# Altium schematic sheet muhtas_1.SchDoc
size A4; SheetNumber: 1; SheetTotal: 1
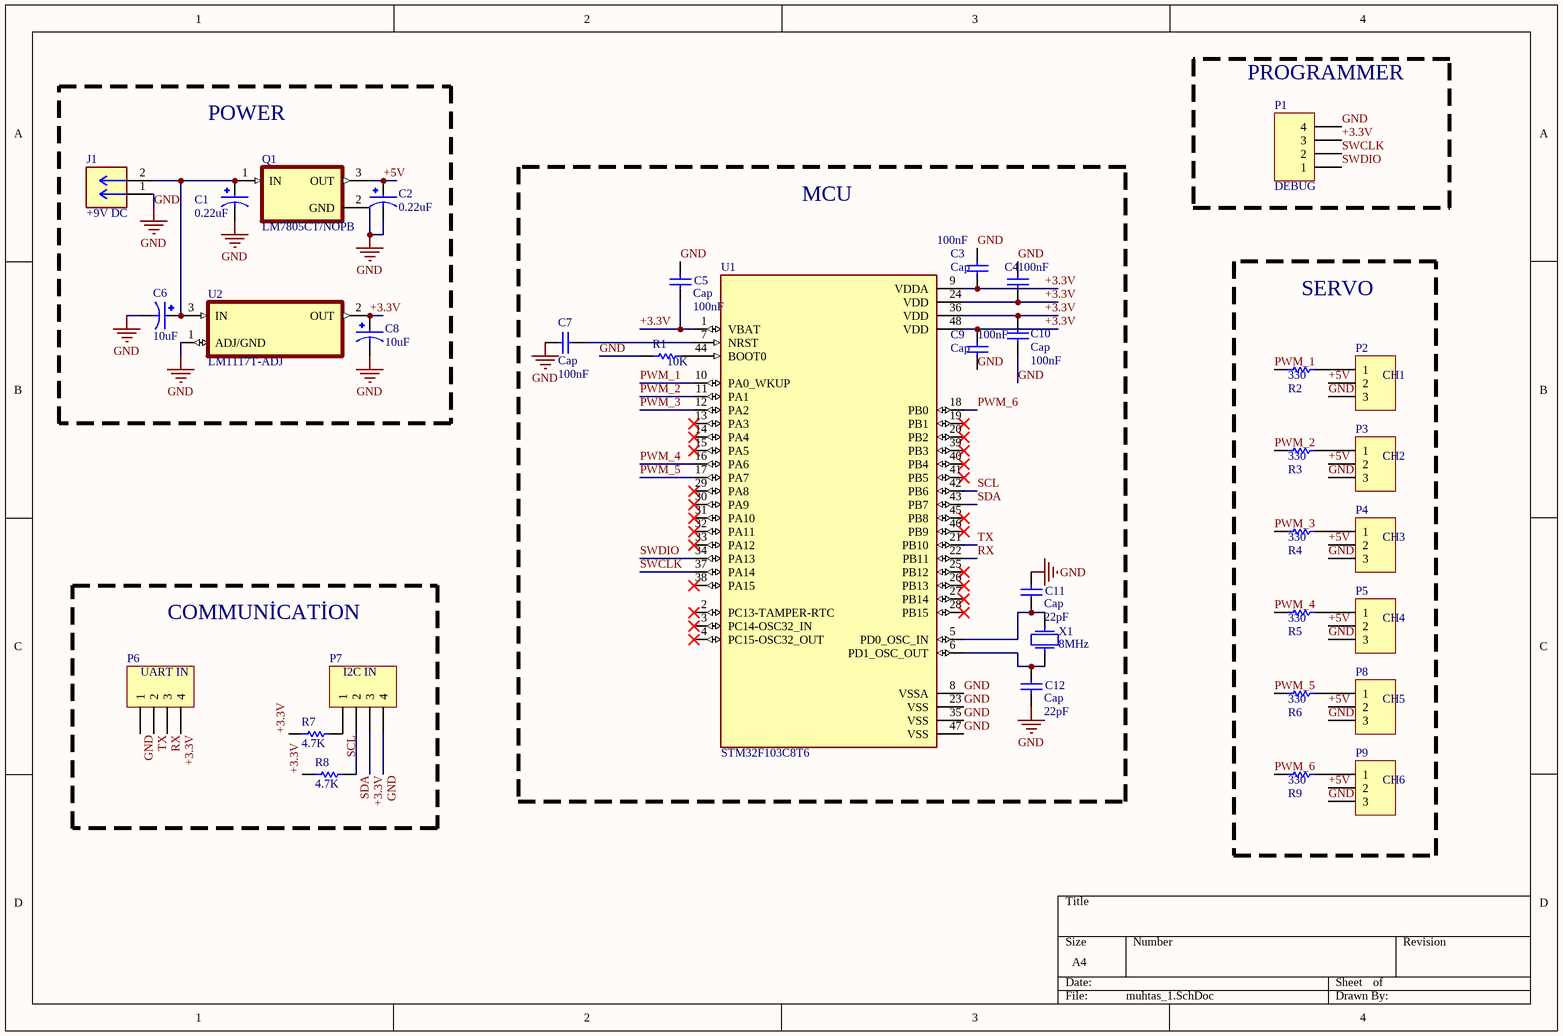
[diagram p0: muhtas_1.SchDoc]

## Parts
C1  0.22uF  [CAPPRD250W50D630H1120]
C2  0.22uF  [CAPPRD250W50D630H1120]
C3  Cap  value 100nF  [CAPPRD250W50D630H1120]
C4  value 100nF  [CAPPRD250W50D630H1120]
C5  Cap  value 100nF  [CAPPRD250W50D630H1120]
C6  10uF  [CAPPRD250W50D630H1120]
C7  Cap  value 100nF  [CAPPRD250W50D630H1120]
C8  10uF  [CAPPRD250W50D630H1120]
C9  Cap  value 100nF  [CAPPRD250W50D630H1120]
C10  Cap  value 100nF  [CAPPRD250W50D630H1120]
C11  Cap  value 22pF  [CAPPRD250W50D630H1120]
C12  Cap  value 22pF  [CAPPRD250W50D630H1120]
J1  +9V DC  [CONN_39773-0002_MOL]
P1  DEBUG  [HDR1X4]
P2  CH1  [HDR1X3]
P3  CH2  [HDR1X3]
P4  CH3  [HDR1X3]
P5  CH4  [HDR1X3]
P6  UART IN  [HDR1X4]
P7  I2C IN  [HDR1X4]
P8  CH5  [HDR1X3]
P9  CH6  [HDR1X3]
Q1  LM7805CT/NOPB  [TO254P1054X470X2600-3]
R1  value 10K  [AXIAL-0.3]  (hidden comment: Resistor)
R2  value 330  [AXIAL-0.3]  (hidden comment: Resistor)
R3  value 330  [AXIAL-0.3]  (hidden comment: Resistor)
R4  value 330  [AXIAL-0.3]  (hidden comment: Resistor)
R5  value 330  [AXIAL-0.3]  (hidden comment: Resistor)
R6  value 330  [AXIAL-0.3]  (hidden comment: Resistor)
R7  value 4.7K  [AXIAL-0.3]  (hidden comment: Resistor)
R8  value 4.7K  [AXIAL-0.3]  (hidden comment: Resistor)
R9  value 330  [AXIAL-0.3]  (hidden comment: Resistor)
U1  STM32F103C8T6  [QFP50P900X900X160-48N]
U2  LM1117T-ADJ  [TO254P1054X470X1955-3]
X1  F0: 8MHz  [RAD-0.1]  (hidden comment: Crystal)

## Blocks framed on the sheet
POWER: C1 C2 C6 C8 J1 Q1 U2
PROGRAMMER: P1
MCU: C3-C5 C7 C9-C12 R1 U1 X1
SERVO: P2-P5 P8 P9 R2-R6 R9
COMMUNİCATİON: P6 P7 R7 R8

## Nets
GND: C1.N C2.N C3.1 C4.1 C5.2 C6.N C7.2 C8.N C9.2 C10.2 C11.2 C12.1 J1.1 P1.4 P2.3 P3.3 P4.3 P5.3 P6.1 P7.4 P8.3 P9.3 Q1.2(GND) R1.1 U1.8(VSSA) U1.23(VSS) U1.35(VSS) U1.47(VSS) U2.1(ADJ/GND)
+3.3V: C3.2 C4.2 C5.1 C8.P C9.1 C10.1 P1.3 P6.4 P7.3 R7.2 R8.2 U1.1(VBAT) U1.9(VDDA) U1.24(VDD) U1.36(VDD) U1.48(VDD) U2.2(OUT)
+5V: C2.P P2.2 P3.2 P4.2 P5.2 P8.2 P9.2 Q1.3(OUT)
PWM_1: R2.1 U1.10(PA0_WKUP)
PWM_2: R3.1 U1.11(PA1)
PWM_3: R4.1 U1.12(PA2)
PWM_4: R5.1 U1.16(PA6)
PWM_5: R6.1 U1.17(PA7)
PWM_6: R9.1 U1.18(PB0)
RX: P6.3 U1.22(PB11)
SCL: P7.1 R7.1 U1.42(PB6)
SDA: P7.2 R8.1 U1.43(PB7)
SWCLK: P1.2 U1.37(PA14)
SWDIO: P1.1 U1.34(PA13)
TX: P6.2 U1.21(PB10)
NetC1_P: C1.P C6.P J1.2 Q1.1(IN) U2.3(IN)
NetC7_1: C7.1 U1.7(NRST)
NetC11_1: C11.1 U1.5(PD0_OSC_IN) X1.2
NetC12_2: C12.2 U1.6(PD1_OSC_OUT) X1.1
NetP2_1: P2.1 R2.2
NetP3_1: P3.1 R3.2
NetP4_1: P4.1 R4.2
NetP5_1: P5.1 R5.2
NetP8_1: P8.1 R6.2
NetP9_1: P9.1 R9.2
NetR1_2: R1.2 U1.44(BOOT0)

Not connected (* = marked no-connect by the designer): U1 2(PC13-TAMPER-RTC)* 3(PC14-OSC32_IN)* 4(PC15-OSC32_OUT)* 13(PA3)* 14(PA4)* 15(PA5)* 19(PB1)* 20(PB2)* 25(PB12)* 26(PB13)* 27(PB14)* 28(PB15)* 29(PA8)* 30(PA9)* 31(PA10)* 32(PA11)* 33(PA12)* 38(PA15)* 39(PB3)* 40(PB4)* 41(PB5)* 45(PB8)* 46(PB9)*

## Library data of the parts
C1 C2 C6 C8 = ECEA1HN100UI: CAP ALUM 10UF 20% 50V RADIAL; MP: ECE-A1HN100UI; MF: Panasonic; SnapEDA_Link: https://www.snapeda.com/parts/ECE-A1HN100UI/Panasonic/view-part/2321690/?ref=snap; Price: None; Check_prices: https://www.snapeda.com/parts/ECE-A1HN100UI/Panasonic/view-part/2321690/?ref=eda; Value: *; Availability: In Stock; Package: RADIAL-2 Panasonic
C3-C5 C7 C9-C12 = Cap: Capacitor; pin to pad: 1>P 2>N; Published: 8-Jun-2000; LatestRevisionDate: 17-Jul-2002; LatestRevisionNote: Re-released for DXP Platform.; PackageReference: RAD-0.3; Publisher: Altium Limited; PackageDescription: Radial Cap, Thru-Hole; 2 Leads; 0.3 in Pin Spacing
J1 = 397730002: 2 Position Wire to Board Terminal Block Horizontal with Board 0.100 (2.54mm) Through Hole; MF: Molex; SnapEDA_Link: https://www.snapeda.com/parts/397730002/Molex/view-part/?ref=snap; Package: None; Value: *; MP: 397730002; Check_prices: https://www.snapeda.com/parts/397730002/Molex/view-part/?ref=eda
P1 P6 P7 = Header 4: Header, 4-Pin; LatestRevisionDate: 17-Jul-2002; LatestRevisionNote: Re-released for DXP Platform.; Publisher: Altium Limited
P2-P5 P8 P9 = Header 3: Header, 3-Pin; LatestRevisionDate: 17-Jul-2002; LatestRevisionNote: Re-released for DXP Platform.; Publisher: Altium Limited
Q1 = LM7805CT/NOPB: Linear Voltage Regulator IC Positive Fixed 1 Output 1.5A TO-220-3; MF: ON Semiconductor; Purchase-URL: https://pricing.snapeda.com/search/part/LM7805CT/?ref=eda; Check_prices: https://www.snapeda.com/parts/LM7805CT/Onsemi/view-part/?ref=eda; SnapEDA_Link: https://www.snapeda.com/parts/LM7805CT/Onsemi/view-part/?ref=snap; Price: None; Availability: In Stock; Package: TO-220-3 ON Semiconductor; MP: LM7805CT; Value: *
R1-R9 = Resistor: TC1: 0; SimulationGenericComponent: True; TC2: 0
U1 = STM32F103C8T6: ARM® Cortex®-M3 STM32F1 Microcontroller IC 32-Bit 72MHz 64KB (64K x 8) FLASH 48-LQFP (7x7); MF: STMicroelectronics; SnapEDA_Link: https://www.snapeda.com/parts/STM32F103C8T6/STMicroelectronics/view-part/?ref=snap; Package: LQFP-48 STMicroelectronics; Value: *; MP: STM32F103C8T6; Check_prices: https://www.snapeda.com/parts/STM32F103C8T6/STMicroelectronics/view-part/?ref=eda
U2 = LM1117T-ADJ: 800-mA 15-V linear voltage regulator; MF: Texas Instruments; MP: LM1117T-ADJ/NOPB; SnapEDA_Link: https://www.snapeda.com/parts/LM1117T-ADJ/NOPB/Texas+Instruments/view-part/?ref=snap; Package: TO-220-3 Texas Instruments; Value: *; Check_prices: https://www.snapeda.com/parts/LM1117T-ADJ/NOPB/Texas+Instruments/view-part/?ref=eda
X1 = Crystal: R: 500; Q: 50K; SimulationGenericComponent: True